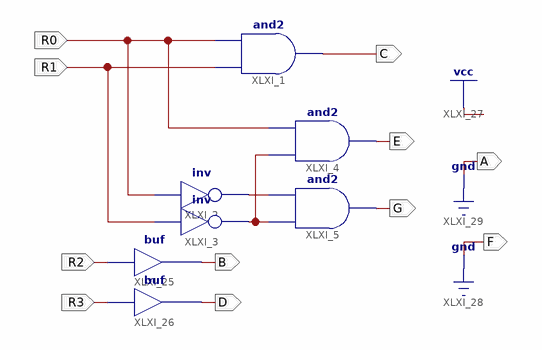
[diagram p0: schematic sheet 1]
// Xilinx ISE schematic ROT_7SEG.sch (spartan6) as structural Verilog: 7 symbols, 11 ports
module ROT_7SEG (
  input  R0,
  input  R1,
  input  R2,
  input  R3,
  output C,
  output E,
  output G,
  output B,
  output D,
  output A,
  output F
);

  wire XLXN_45, XLXN_46;

  and XLXI_1 (C, R1, R0);
  not XLXI_2 (XLXN_46, R0);
  not XLXI_3 (XLXN_45, R1);
  and XLXI_4 (E, XLXN_45, R0);
  and XLXI_5 (G, XLXN_45, XLXN_46);
  buf XLXI_25 (B, R2);
  buf XLXI_26 (D, R3);

  assign A = 1'b0;
  assign F = 1'b0;
endmodule
